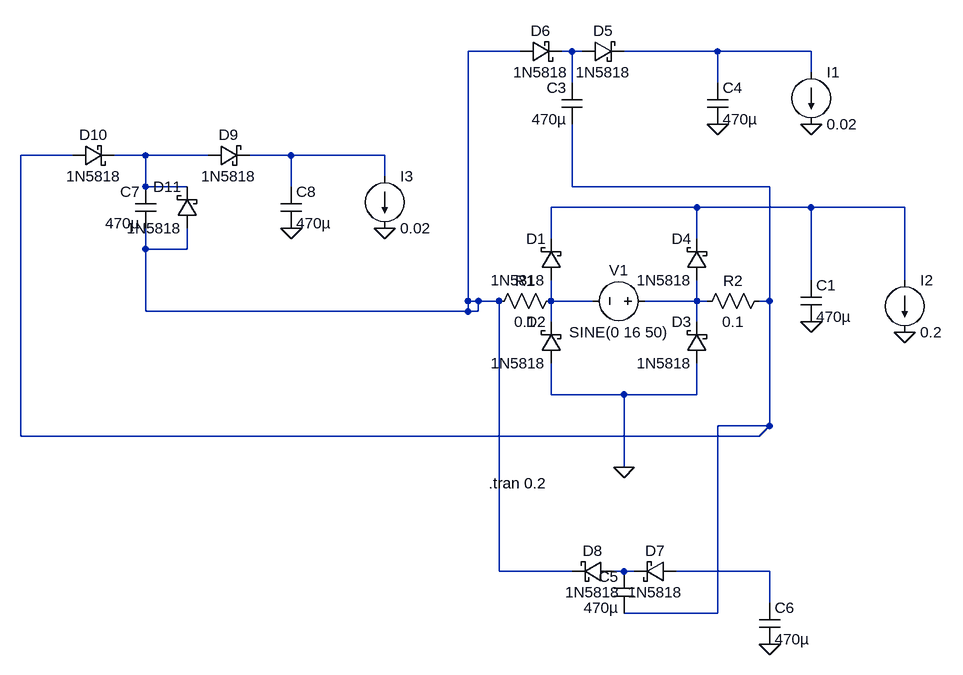
[diagram p0: schematic voltage_doubler_etc.asc]
voltage_doubler_etc.asc, the LTspice schematic file:
Version 4
SHEET 1 944 724
WIRE 272 -208 192 -208
WIRE 352 -208 336 -208
WIRE 368 -208 352 -208
WIRE 576 -208 432 -208
WIRE 720 -208 576 -208
WIRE 720 -176 720 -208
WIRE 352 -160 352 -208
WIRE 576 -160 576 -208
WIRE -416 -48 -496 -48
WIRE -304 -48 -352 -48
WIRE -208 -48 -304 -48
WIRE -80 -48 -144 -48
WIRE 64 -48 -80 -48
WIRE 64 -16 64 -48
WIRE -304 0 -304 -48
WIRE -240 0 -304 0
WIRE -80 0 -80 -48
WIRE 352 0 352 -96
WIRE 656 0 352 0
WIRE 544 32 320 32
WIRE 720 32 544 32
WIRE 864 32 720 32
WIRE 320 80 320 32
WIRE 544 80 544 32
WIRE -304 96 -304 64
WIRE -240 96 -240 64
WIRE -240 96 -304 96
WIRE 720 144 720 32
WIRE 864 144 864 32
WIRE 192 176 192 -208
WIRE 208 176 192 176
WIRE 240 176 208 176
WIRE 320 176 320 144
WIRE 384 176 320 176
WIRE 544 176 544 144
WIRE 544 176 464 176
WIRE 560 176 544 176
WIRE 656 176 656 0
WIRE 656 176 640 176
WIRE -304 192 -304 96
WIRE 192 192 192 176
WIRE 192 192 -304 192
WIRE 208 192 208 176
WIRE 208 192 192 192
WIRE 320 208 320 176
WIRE 544 208 544 176
WIRE 320 320 320 272
WIRE 432 320 320 320
WIRE 544 320 544 272
WIRE 544 320 432 320
WIRE 656 368 656 176
WIRE 656 368 576 368
WIRE -496 384 -496 -48
WIRE 640 384 656 368
WIRE 640 384 -496 384
WIRE 432 432 432 320
WIRE 240 592 240 176
WIRE 352 592 240 592
WIRE 432 592 416 592
WIRE 448 592 432 592
WIRE 656 592 512 592
WIRE 656 640 656 592
WIRE 576 656 576 368
WIRE 576 656 432 656
FLAG 432 432 0
FLAG 720 208 0
FLAG 576 -96 0
FLAG 720 -96 0
FLAG 864 224 0
FLAG 656 704 0
FLAG -80 64 0
FLAG 64 64 0
SYMBOL voltage 480 176 M270
WINDOW 0 32 56 VTop 2
WINDOW 3 -32 56 VBottom 2
WINDOW 123 0 0 Left 0
WINDOW 39 0 0 Left 0
SYMATTR InstName V1
SYMATTR Value SINE(0 16 50)
SYMBOL schottky 336 144 R180
WINDOW 0 24 64 Left 2
WINDOW 3 24 0 Left 2
SYMATTR InstName D1
SYMATTR Value 1N5818
SYMATTR Description Diode
SYMATTR Type diode
SYMBOL schottky 336 272 R180
WINDOW 0 24 64 Left 2
WINDOW 3 24 0 Left 2
SYMATTR InstName D2
SYMATTR Value 1N5818
SYMATTR Description Diode
SYMATTR Type diode
SYMBOL schottky 560 272 R180
WINDOW 0 24 64 Left 2
WINDOW 3 24 0 Left 2
SYMATTR InstName D3
SYMATTR Value 1N5818
SYMATTR Description Diode
SYMATTR Type diode
SYMBOL schottky 560 144 R180
WINDOW 0 24 64 Left 2
WINDOW 3 24 0 Left 2
SYMATTR InstName D4
SYMATTR Value 1N5818
SYMATTR Description Diode
SYMATTR Type diode
SYMBOL cap 704 144 R0
SYMATTR InstName C1
SYMATTR Value 470µ
SYMATTR SpiceLine Rser=0.1
SYMBOL schottky 368 -192 R270
WINDOW 0 32 32 VTop 2
WINDOW 3 0 32 VBottom 2
SYMATTR InstName D5
SYMATTR Value 1N5818
SYMATTR Description Diode
SYMATTR Type diode
SYMBOL schottky 272 -224 M90
WINDOW 0 0 32 VBottom 2
WINDOW 3 32 32 VTop 2
SYMATTR InstName D6
SYMATTR Value 1N5818
SYMATTR Description Diode
SYMATTR Type diode
SYMBOL cap 368 -96 R180
WINDOW 0 24 56 Left 2
WINDOW 3 24 8 Left 2
SYMATTR InstName C3
SYMATTR Value 470µ
SYMATTR SpiceLine Rser=0.1
SYMBOL cap 560 -160 R0
SYMATTR InstName C4
SYMATTR Value 470µ
SYMATTR SpiceLine Rser=0.1
SYMBOL current 720 -176 R0
WINDOW 123 0 0 Left 0
WINDOW 39 0 0 Left 0
SYMATTR InstName I1
SYMATTR Value 0.02
SYMBOL current 864 144 R0
WINDOW 123 0 0 Left 0
WINDOW 39 0 0 Left 0
SYMATTR InstName I2
SYMATTR Value 0.2
SYMBOL schottky 512 576 R90
WINDOW 0 0 32 VBottom 2
WINDOW 3 32 32 VTop 2
SYMATTR InstName D7
SYMATTR Value 1N5818
SYMATTR Description Diode
SYMATTR Type diode
SYMBOL schottky 416 608 M270
WINDOW 0 32 32 VTop 2
WINDOW 3 0 32 VBottom 2
SYMATTR InstName D8
SYMATTR Value 1N5818
SYMATTR Description Diode
SYMATTR Type diode
SYMBOL cap 448 656 R180
WINDOW 0 24 56 Left 2
WINDOW 3 24 8 Left 2
SYMATTR InstName C5
SYMATTR Value 470µ
SYMATTR SpiceLine Rser=0.1
SYMBOL cap 640 640 R0
SYMATTR InstName C6
SYMATTR Value 470µ
SYMATTR SpiceLine Rser=0.1
SYMBOL schottky -208 -32 R270
WINDOW 0 32 32 VTop 2
WINDOW 3 0 32 VBottom 2
SYMATTR InstName D9
SYMATTR Value 1N5818
SYMATTR Description Diode
SYMATTR Type diode
SYMBOL schottky -416 -64 M90
WINDOW 0 0 32 VBottom 2
WINDOW 3 32 32 VTop 2
SYMATTR InstName D10
SYMATTR Value 1N5818
SYMATTR Description Diode
SYMATTR Type diode
SYMBOL cap -288 64 R180
WINDOW 0 24 56 Left 2
WINDOW 3 24 8 Left 2
SYMATTR InstName C7
SYMATTR Value 470µ
SYMATTR SpiceLine Rser=0.1
SYMBOL cap -96 0 R0
SYMATTR InstName C8
SYMATTR Value 470µ
SYMATTR SpiceLine Rser=0.1
SYMBOL current 64 -16 R0
WINDOW 123 0 0 Left 0
WINDOW 39 0 0 Left 0
SYMATTR InstName I3
SYMATTR Value 0.02
SYMBOL res 336 160 R90
WINDOW 0 0 56 VBottom 2
WINDOW 3 32 56 VTop 2
SYMATTR InstName R1
SYMATTR Value 0.1
SYMBOL res 656 160 R90
WINDOW 0 0 56 VBottom 2
WINDOW 3 32 56 VTop 2
SYMATTR InstName R2
SYMATTR Value 0.1
SYMBOL schottky -224 64 R180
WINDOW 0 24 64 Left 2
WINDOW 3 24 0 Left 2
SYMATTR InstName D11
SYMATTR Value 1N5818
SYMATTR Description Diode
SYMATTR Type diode
TEXT 224 456 Left 2 !.tran 0.2

The netlist it stands for:
* voltage_doubler_etc.asc
V1 N009 N008 SINE(0 16 50)
D1 N008 N007 1N5818
D2 0 N008 1N5818
D3 0 N009 1N5818
D4 N009 N007 1N5818
C1 N007 0 470µ Rser=0.1
D5 N002 N003 1N5818
D6 N001 N002 1N5818
C3 N004 N002 470µ Rser=0.1
C4 N003 0 470µ Rser=0.1
I1 N003 0 0.02
I2 N007 0 0.2
D7 N011 N010 1N5818
D8 N010 N001 1N5818
C5 N004 N010 470µ Rser=0.1
C6 N011 0 470µ Rser=0.1
D9 N005 N006 1N5818
D10 N004 N005 1N5818
C7 N001 N005 470µ Rser=0.1
C8 N006 0 470µ Rser=0.1
I3 N006 0 0.02
R1 N008 N001 0.1
R2 N004 N009 0.1
D11 N001 N005 1N5818
.model D D
.lib standard.dio
.tran 0.2
.backanno
.end